# EAGLE design Prototype Board bad routing (EAGLE 9.6.2)
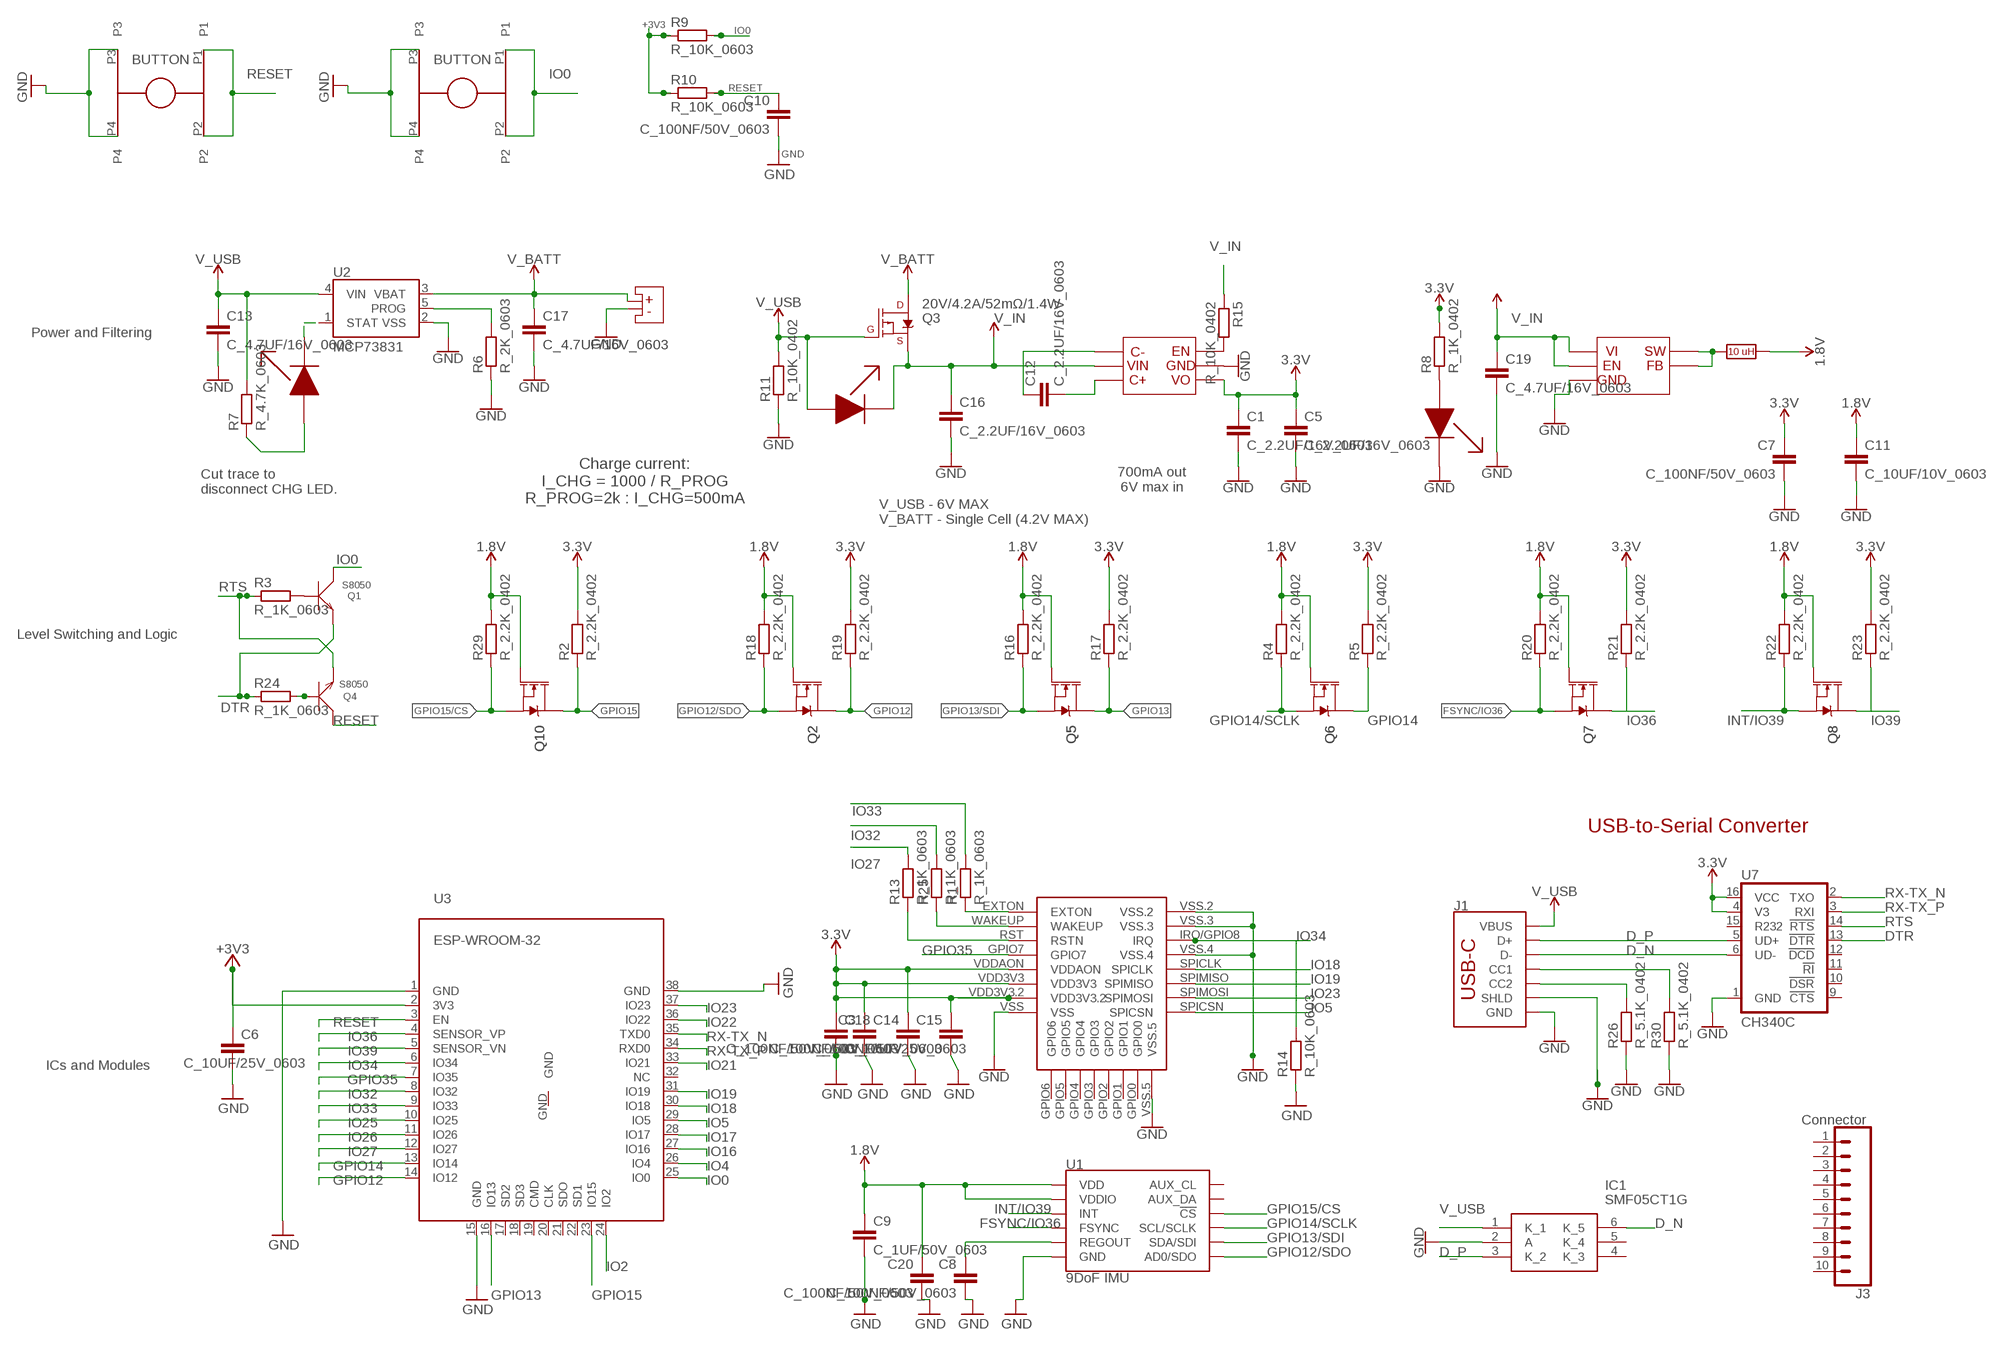
[diagram p0: schematic, sheet 1]

## Parts
C1  C_2.2UF/16V_0603  [C0603]
C3  C_100NF/50V_0603  [C0603]
C5  C_2.2UF/16V_0603  [C0603]
C6  C_10UF/25V_0603  [C0603]
C7  C_100NF/50V_0603  [C0603]
C8  C_100NF/50V_0603  [C0603]
C9  C_1UF/50V_0603  [C0603]
C10  C_100NF/50V_0603  [C0603]
C11  C_10UF/10V_0603  [C0603]
C12  C_2.2UF/16V_0603  [C0603]
C13  C_4.7UF/16V_0603  [C0603]
C14  C_100NF/50V_0603  [C0603]
C15  C_100NF/50V_0603  [C0603]
C16  C_2.2UF/16V_0603  [C0603]
C17  C_4.7UF/16V_0603  [C0603]
C18  C_10UF/25V_0603  [C0603]
C19  C_4.7UF/16V_0603  [C0603]
C20  C_100NF/50V_0603  [C0603]
IC1  SMF05CT1G  [SOT65P210X110-6N]
J1  USB Type C  USB_C_2-LAYER_PADS  [USB-C-16P-2LAYER-PADS]
J3  Connector  CONN_10"  [1X10]
Q1  S8050  TRANSISTOR-NPN-SOT23  [SOT23]
Q2  20V/0.2A/8MHz/1.2Ω/1Vth  MOSFET-NCH-RE1C002UN  [SOT-416FL]
Q3  20V/4.2A/52mΩ/1.4W  MOSFET_PCH-DMG2305UX-7  [SOT23-3@1]
Q4  S8050  TRANSISTOR-NPN-SOT23  [SOT23]
Q5  20V/0.2A/8MHz/1.2Ω/1Vth  MOSFET-NCH-RE1C002UN  [SOT-416FL]
Q6  20V/0.2A/8MHz/1.2Ω/1Vth  MOSFET-NCH-RE1C002UN  [SOT-416FL]
Q7  20V/0.2A/8MHz/1.2Ω/1Vth  MOSFET-NCH-RE1C002UN  [SOT-416FL]
Q8  20V/0.2A/8MHz/1.2Ω/1Vth  MOSFET-NCH-RE1C002UN  [SOT-416FL]
Q10  20V/0.2A/8MHz/1.2Ω/1Vth  MOSFET-NCH-RE1C002UN  [SOT-416FL]
R1  R_1K_0603  [R0603]
R2  R_2.2K_0402  [R0402]
R3  R_1K_0603  [R0603]
R4  R_2.2K_0402  [R0402]
R5  R_2.2K_0402  [R0402]
R6  R_2K_0603  [R0603]
R7  R_4.7K_0603  [R0603]
R8  R_1K_0402  [R0402]
R9  R_10K_0603  [R0603]
R10  R_10K_0603  [R0603]
R11  R_10K_0402  [R0402]
R13  R_1K_0603  [R0603]
R14  R_10K_0603  [R0603]
R15  R_10K_0402  [R0402]
R16  R_2.2K_0402  [R0402]
R17  R_2.2K_0402  [R0402]
R18  R_2.2K_0402  [R0402]
R19  R_2.2K_0402  [R0402]
R20  R_2.2K_0402  [R0402]
R21  R_2.2K_0402  [R0402]
R22  R_2.2K_0402  [R0402]
R23  R_2.2K_0402  [R0402]
R24  R_1K_0603  [R0603]
R25  R_1K_0603  [R0603]
R26  R_5.1K_0402  [R0402]
R29  R_2.2K_0402  [R0402]
R30  R_5.1K_0402  [R0402]
U1  9DoF IMU  ICM-20948  [QFN24-3X3]
U2  MCP73831  [SOT23-5]
U3  ESP-WROOM-32  [ESP-WROOM-32]
U5  DWM1000  [DWM1000]
U7  CH340C  [SO016]
U$1  K2-6639SP-C4SC-04_C83206  [K2-6639SP-C4SC-04]
U$2  MLF2012  [MLF2012]
U$3  K2-6639SP-C4SC-04_C83206  [K2-6639SP-C4SC-04]
U$4  TPS62202DBVR  [TPS62202DBVR]
U$5  HE9008M6R  [HE9008M6R]
U$6  19-217/GHC-YR1S2/3T  [19-217/GHC-YR1S2/3T]
U$7  19-217/GHC-YR1S2/3T  [19-217/GHC-YR1S2/3T]
U$8  SM02B_PASS_TB_LF  [SM02B_PASS_TB_LF]
U$9  19-217/GHC-YR1S2/3T  [19-217/GHC-YR1S2/3T]

## Nets
1.8V: C9.1 C11.1 C20.1 Q2.1(G) Q5.1(G) Q6.1(G) Q7.1(G) Q8.1(G) Q10.1(G) R4.2 R16.2 R18.2 R20.2 R22.2 R29.2 U1.8(VDDIO) U1.13(VDD) U$2.2
3.3V: C1.1 C3.1 C5.1 C7.1 C14.1 C15.1 C18.1 R2.2 R5.2 R8.2 R17.2 R19.2 R21.2 R23.2 U5.VDD3V3 U5.VDD3V3.2 U5.VDDAON U7.4(V3) U7.16(VCC) U$5.VOUT(VO)
+3V3: C6.1 R9.1 R10.1 U3.2(3V3)
CHG_LED: R7.1 U$6.1
D_N [diff-pair-D]: IC1.6(K_5) J1.A7(D-) J1.B7(D-) U7.6(UD-)
D_P [diff-pair-D]: IC1.3(K_2) J1.A6(D+) J1.B6(D+) U7.5(UD+)
DTR: Q1.2(E) R24.1 U7.13(!DTR)
FSYNC/IO36: Q7.2(S) R20.1 U1.11(FSYNC)
GND: C1.2 C3.2 C5.2 C6.2 C7.2 C8.2 C9.2 C10.2 C11.2 C13.2 C14.2 C15.2 C16.2 C17.2 C18.2 C19.2 C20.2 IC1.2(A) J1.GND J1.GND2(GND) J1.SHLD1(SHLD) J1.SHLD2(SHLD) J1.SHLD3(SHLD) J1.SHLD4(SHLD) R6.1 R11.1 R14.1 R26.1 R30.1 U1.18(GND) U1.20(GND) U2.2(VSS) U3.1(GND) U3.15(GND) U3.38(GND) U5.VSS U5.VSS.2 U5.VSS.3 U5.VSS.4 U5.VSS.5 U7.1(GND) U$1.P3 U$1.P4 U$3.P3 U$3.P4 U$4.2(GND) U$5.GND U$8.3(-) U$9.2
GPIO12: Q2.3(D) R19.1 U3.14(IO12)
GPIO12/SDO: Q2.2(S) R18.1 U1.9(AD0/SDO)
GPIO13: Q5.3(D) R17.1 U3.16(IO13)
GPIO13/SDI: Q5.2(S) R16.1 U1.24(SDA/SDI)
GPIO14: Q6.3(D) R5.1 U3.13(IO14)
GPIO14/SCLK: Q6.2(S) R4.1 U1.23(SCL/SCLK)
GPIO15: Q10.3(D) R2.1 U3.23(IO15)
GPIO15/CS: Q10.2(S) R29.1 U1.22(!CS)
GPIO35: U3.7(IO35) U5.GPIO7
INT/IO39: Q8.2(S) R22.1 U1.12(INT)
IO0: Q1.3(C) R9.2 U3.25(IO0) U$3.P1 U$3.P2
IO2: U3.24(IO2)
IO4: U3.26(IO4)
IO5: U3.29(IO5) U5.SPICSN
IO16: U3.27(IO16)
IO17: U3.28(IO17)
IO18: U3.30(IO18) U5.SPICLK
IO19: U3.31(IO19) U5.SPIMISO
IO21: U3.33(IO21)
IO22: U3.36(IO22)
IO23: U3.37(IO23) U5.SPIMOSI
IO25: U3.10(IO25)
IO26: U3.11(IO26)
IO27: R13.2 U3.12(IO27)
IO32: R25.2 U3.8(IO32)
IO33: R1.2 U3.9(IO33)
IO34: R14.2 U3.6(IO34) U5.IRQ/GPIO8(IRQ)
IO36: Q7.3(D) R21.1 U3.4(SENSOR_VP)
IO39: Q8.3(D) R23.1 U3.5(SENSOR_VN)
N$1: Q4.1(B) R24.2
N$2: Q1.1(B) R3.2
N$3: R6.2 U2.5(PROG)
N$4: R8.1 U$9.1
N$5: J1.B5(CC2) R26.2
N$6: J1.A5(CC1) R30.2
N$7: U2.1(STAT) U$6.2
N$8: U$2.1 U$4.4(FB) U$4.5(SW)
N$9: R15.2 U$5.EN
N$10: R1.1 U5.EXTON
N$11: R25.1 U5.WAKEUP
N$12: R13.1 U5.RST(RSTN)
N$13: C8.1 U1.10(REGOUT)
N$14: C12.1 U$5.C-
N$15: C12.2 U$5.C+
RESET: C10.1 Q4.3(C) R10.2 U3.3(EN) U$1.P1 U$1.P2
RTS: Q4.2(E) R3.1 U7.14(!RTS)
RX-TX_N [diff-pair-RT]: U3.35(TXD0) U7.2(TXO)
RX-TX_P [diff-pair-RT]: U3.34(RXD0) U7.3(RXI)
V_BATT: C17.1 Q3.3(D) U2.3(VBAT) U$8.4(+)
V_IN: C16.1 C19.1 Q3.2(S) R15.1 U$4.1(VI) U$4.3(EN) U$5.VIN U$7.2 ; supply symbol labelled VIN
V_USB: C13.1 IC1.1(K_1) J1.VBUS1(VBUS) J1.VBUS2(VBUS) Q3.1(G) R7.2 R11.2 U2.4(VIN) U$7.1
Unconnected: IC1.4(K_3) IC1.5(K_4) J3.1 J3.2 J3.3 J3.4 J3.5 J3.6 J3.7 J3.8 J3.9 J3.10 U1.7(AUX_CL) U1.21(AUX_DA) U3.17(SD2) U3.18(SD3) U3.19(CMD) U3.20(CLK) U3.21(SDO) U3.22(SD1) U3.32(NC) U3.GND U5.GPIO0 U5.GPIO1 U5.GPIO2 U5.GPIO3 U5.GPIO4 U5.GPIO5 U5.GPIO6 U7.9(!CTS) U7.10(!DSR) U7.11(!RI) U7.12(!DCD) U7.15(R232)

## Notes on the sheet
- Power and Filtering
- 700mA out
  6V max in
- Charge current:
  I_CHG = 1000 / R_PROG
  R_PROG=2k : I_CHG=500mA
- Cut trace to 
  disconnect CHG LED.
- V_USB - 6V MAX
  V_BATT - Single Cell (4.2V MAX)
- Level Switching and Logic
- USB-to-Serial Converter
- ICs and Modules

## Library data of the parts
C1 C5 C12 C16 = JLC PCB Basic Parts_loc:C_: Capacitor General purpose SMD Capacitor; LCSC_DATASHEET: https://datasheet.lcsc.com/lcsc/1810271109_Samsung-Electro-Mechanics-CL10A225KO8NNNC_C23630.pdf; LCSC_PART: C23630; LCSC_ROTATION_CCW: 0; LCSC_STOCK: 1324345; PROPERTIES: 16V 2.2uF X5R ±10% 0603 ROHS
C3 C7 C8 C10 C14 C15 C20 = JLC PCB Basic Parts_loc:C_: Capacitor General purpose SMD Capacitor; LCSC_DATASHEET: https://datasheet.lcsc.com/lcsc/1809301912_YAGEO-CC0603KRX7R9BB104_C14663.pdf; LCSC_PART: C14663; LCSC_ROTATION_CCW: 0; LCSC_STOCK: 7111530; PROPERTIES: 50V 100nF X7R ±10% 0603 ROHS
C6 C18 = JLC PCB Basic Parts_loc:C_: Capacitor General purpose SMD Capacitor; LCSC_DATASHEET: https://datasheet.lcsc.com/lcsc/1811110921_Samsung-Electro-Mechanics-CL10A106MA8NRNC_C96446.pdf; LCSC_PART: C96446; LCSC_ROTATION_CCW: 0; LCSC_STOCK: 119091; PROPERTIES: X5R 25V ±20% 10uF 0603 ROHS
C9 = JLC PCB Basic Parts_loc:C_: Capacitor General purpose SMD Capacitor; LCSC_DATASHEET: https://datasheet.lcsc.com/lcsc/1810261812_Samsung-Electro-Mechanics-CL10A105KB8NNNC_C15849.pdf; LCSC_PART: C15849; LCSC_ROTATION_CCW: 0; LCSC_STOCK: 14650365; PROPERTIES: 50V 1uF X5R ±10% 0603 ROHS
C11 = JLC PCB Basic Parts_loc:C_: Capacitor General purpose SMD Capacitor; LCSC_DATASHEET: https://datasheet.lcsc.com/lcsc/1810191219_Samsung-Electro-Mechanics-CL10A106KP8NNNC_C19702.pdf; LCSC_PART: C19702; LCSC_ROTATION_CCW: 0; LCSC_STOCK: 2089400; PROPERTIES: 10V 10uF X5R ±10% 0603 ROHS
C13 C17 C19 = JLC PCB Basic Parts_loc:C_: Capacitor General purpose SMD Capacitor; LCSC_DATASHEET: https://datasheet.lcsc.com/lcsc/1810261514_Samsung-Electro-Mechanics-CL10A475KO8NNNC_C19666.pdf; LCSC_PART: C19666; LCSC_ROTATION_CCW: 0; LCSC_STOCK: 2027167; PROPERTIES: 16V 4.7uF X5R ±10% 0603 ROHS
IC1 = SMF05CT1G:SMF05CT1G: 5-Line Transient Voltage Suppressor Array Source: Datasheet; DESCRIPTION: 5-Line Transient Voltage Suppressor Array; HEIGHT: 1.1mm; MANUFACTURER_NAME: onsemi; MANUFACTURER_PART_NUMBER: SMF05CT1G; MOUSER_PART_NUMBER: 863-SMF05CT1G; MOUSER_PRICE-STOCK: https://www.mouser.co.uk/ProductDetail/onsemi/SMF05CT1G?qs=xZq1yRCsb1c8sZHBbx4IBw%3D%3D
J1 = SparkFun-Connectors:USB_C: USB Type C 16Pin Connector Super Speed pins not available on the 16-pin purely SMD connector so this part is best for USB 2.0 implementations. D1 and D2 are tied together enabling D+/- no matter which way the cable is plugged into the connector. The two channel configuration pins (CC1/2) are exposed. These are normally connected to ground via 5.1k resistors but can be reconfigured for high current/high power applications. **4-LAYER BOARD WARNING!!** If designing 4-layer board, make sure to select the variant _4-LAYER-ISOLATED. The linked footprint (USB-C-16-4LAYER-ISOLATED) includes some very necessary cutout polygons in the inner layers (2 and 15). This prevents the PTH mounting shield legs on the USB connector from electrically connecting any other polygons on the inner layers (usually VCC and GND).; PROD_ID: CONN-14122
J3 = SparkFun-Connectors:CONN_10: Multi connection point. Often used as Generic Header-pin footprint for 0.1 inch spaced/style header connections On any of the 0.1 inch spaced packages, you can populate with these: Break Away Headers - Straight (PRT-00116) Break Away Male Headers - Right Angle (PRT-00553) Female Headers (PRT-00115) Break Away Headers - Machine Pin (PRT-00117) Break Away Female Headers - Swiss Machine Pin (PRT-00743) Arduino Stackable Header - 10 Pin (PRT-11376) For SCREWTERMINALS and SPRING TERMINALS visit here: Screw Terimnals on SparkFun.com (5mm/3.5mm/2.54mm spacing) This device is also useful as a general connection point to wire up your design to another part of your project. Our various solder wires solder well into these plated through hole pads. Hook-Up Wire - Assortment (Stranded, 22 AWG) (PRT-11375) Hook-Up Wire - Assortment (Solid Core, 22 AWG) (PRT-11367) View the entire wire category on our website here Special notes: Molex polarized connector foot print use with SKU : PRT-08231 with associated crimp pins and housings. 1MM SMD Version SKU: PRT-10208 NOTES ON THE VARIANTS LOCK and LOCK_LONGPADS... This footprint was designed to help hold the alignment of a through-hole component (i.e. 6-pin header) while soldering it into place. You may notice that each hole has been shifted either up or down by 0.005 of an inch from it's more standard position (which is a perfectly straight line). This slight alteration caused the pins (the squares in the middle) to touch the edges of the holes. Because they are alternating, it causes a "brace" to hold the component in place. 0.005 has proven to be the perfect amount of "off-center" position when using our standard breakaway headers. Although looks a little odd when you look at the bare footprint, once you have a header in there, the alteration is very hard to notice. Also,if you push a header all the way into place, it is covered up entirely on the bottom side.; PROD_ID: CONN-11563
Q1 Q4 = Discrete:TRANSISTOR-NPN*: NPN audion
Q2 Q5-Q8 Q10 = SparkFun-DiscreteSemi:MOSFET-NCH: N-channel MOSFETs Voltage controlled devices that allow control of high current outputs. SparkFun Products: SparkFun OpenScale <https://www.sparkfun.com/products/13261> SparkFun Digital Sandbox <https://www.sparkfun.com/products/12651> SparkFun Monster Moto Shield <https://www.sparkfun.com/products/10182> SparkFun MOSFET Power Controller <https://www.sparkfun.com/products/11214>; PROD_ID: TRANS_14399
Q3 = SparkFun-DiscreteSemi:MOSFET_PCH: P-channel MOSFETs Voltage controlled devices that allow control of high current outputs. SparkFun Products: SparkFun ESP32 Thing <https://www.sparkfun.com/products/13907> SparkFun ESP8266 Thing <https://www.sparkfun.com/products/13231> SparkFun Pi Servo HAT V2 <https://www.sparkfun.com/products/15316> DMG2305UX-7 (20V/4.2A/SOT23-3); PROD_ID: TRANS-14388
R1 R3 R13 R24 R25 = JLC PCB Basic Parts_loc:R_: Resistor General purpose SMD Resistor; LCSC_DATASHEET: https://datasheet.lcsc.com/lcsc/2110252030_UNI-ROYAL-Uniroyal-Elec-0603WAF1001T5E_C21190.pdf; LCSC_PART: C21190; LCSC_ROTATION_CCW: 0; LCSC_STOCK: 5175299; PROPERTIES: ±1% 1/10W Thick Film Resistors 75V ±100ppm -55°C~+155°C 1kOhm 0603 ROHS
R2 R4 R5 R16-R23 R29 = JLC PCB Basic Parts_loc:R_: Resistor General purpose SMD Resistor; LCSC_DATASHEET: https://datasheet.lcsc.com/lcsc/2110260030_UNI-ROYAL-Uniroyal-Elec-0402WGF2201TCE_C25879.pdf; LCSC_PART: C25879; LCSC_ROTATION_CCW: 0; LCSC_STOCK: 387501; PROPERTIES: ±1% 1/16W Thick Film Resistors 50V ±100ppm -55°C~+155°C 2.2kOhm 0402 ROHS
R6 = JLC PCB Basic Parts_loc:R_: Resistor General purpose SMD Resistor; LCSC_DATASHEET: https://datasheet.lcsc.com/lcsc/2110252130_UNI-ROYAL-Uniroyal-Elec-0603WAF2001T5E_C22975.pdf; LCSC_PART: C22975; LCSC_ROTATION_CCW: 0; LCSC_STOCK: 3372290; PROPERTIES: ±1% 1/10W Thick Film Resistors 75V ±100ppm -55°C~+155°C 2kOhm 0603 ROHS
R7 = JLC PCB Basic Parts_loc:R_: Resistor General purpose SMD Resistor; LCSC_DATASHEET: https://datasheet.lcsc.com/lcsc/2110252130_UNI-ROYAL-Uniroyal-Elec-0603WAF4701T5E_C23162.pdf; LCSC_PART: C23162; LCSC_ROTATION_CCW: 0; LCSC_STOCK: 3103173; PROPERTIES: ±1% 1/10W Thick Film Resistors 75V ±100ppm -55°C~+155°C 4.7kOhm 0603 ROHS
R8 = JLC PCB Basic Parts_loc:R_: Resistor General purpose SMD Resistor; LCSC_DATASHEET: https://datasheet.lcsc.com/lcsc/2110251730_UNI-ROYAL-Uniroyal-Elec-0402WGF1001TCE_C11702.pdf; LCSC_PART: C11702; LCSC_ROTATION_CCW: 0; LCSC_STOCK: 3758383; PROPERTIES: ±1% 1/16W Thick Film Resistors 50V ±100ppm -55°C~+155°C 1kOhm 0402 ROHS
R9 R10 R14 = JLC PCB Basic Parts_loc:R_: Resistor General purpose SMD Resistor; LCSC_DATASHEET: https://datasheet.lcsc.com/lcsc/2110260030_UNI-ROYAL-Uniroyal-Elec-0603WAF1002T5E_C25804.pdf; LCSC_PART: C25804; LCSC_ROTATION_CCW: 0; LCSC_STOCK: 7979018; PROPERTIES: ±1% 1/10W Thick Film Resistors 75V ±100ppm -55°C~+155°C 10kOhm 0603 ROHS
R11 R15 = JLC PCB Basic Parts_loc:R_: Resistor General purpose SMD Resistor; LCSC_DATASHEET: https://datasheet.lcsc.com/lcsc/2110260030_UNI-ROYAL-Uniroyal-Elec-0402WGF1002TCE_C25744.pdf; LCSC_PART: C25744; LCSC_ROTATION_CCW: 0; LCSC_STOCK: 11564817; PROPERTIES: ±1% 1/16W Thick Film Resistors 50V ±100ppm -55°C~+155°C 10kOhm 0402 ROHS
R26 R30 = JLC PCB Basic Parts_loc:R_: Resistor General purpose SMD Resistor; LCSC_DATASHEET: https://datasheet.lcsc.com/lcsc/2110260030_UNI-ROYAL-Uniroyal-Elec-0402WGF5101TCE_C25905.pdf; LCSC_PART: C25905; LCSC_ROTATION_CCW: 0; LCSC_STOCK: 1228443; PROPERTIES: ±1% 1/16W Thick Film Resistors 50V ±100ppm -55°C~+155°C 5.1kOhm 0402 ROHS
U1 = SparkFun-Sensors:ICM-20948: ICM-20948 9 Degree of Freedom IMU World’s lowest power 9-axis MotionTracking device that is ideally suited for smartphones, tablets, wearable sensors, and IoT applications. Includes onboard Digital Motion Processor to offload computations from the host processor Datasheet <https://cdn.sparkfun.com/assets/learn_tutorials/5/5/0/MPU9250REV1.0.pdf> SparkFun Products: SparkFun IMU Breakout - ICM-20948 <https://www.sparkfun.com/products/15182>; PROD_ID: IC-14247
U2 = SparkFun-IC-Power:MCP73831: MCP73831T Li-Ion, Li-Pol Controller Miniature single cell, fully integrated Li-Ion, Li-polymer charge management controller Datasheet <http://ww1.microchip.com/downloads/en/DeviceDoc/20001984g.pdf> SparkFun Products: SparkFun ESP32 Thing <https://www.sparkfun.com/products/13907> SparkFun 9DoF Razor IMU M0 <https://www.sparkfun.com/products/14001>; PROD_ID: IC-09995
U3 = ESP32:ESP-WROOM-32
U5 = DWM1000:DWM1000
U7 = SparkFun-IC-Comms:CH340C; PROD_ID: IC-14038
U$1 U$3 = customlib:K2-6639SP-C4SC-04_C83206: K2-6639SP-C4SC-04_C83206 button, https://datasheet.lcsc.com/lcsc/2108131530_Korean-Hroparts-Elec-K2-6639SP-C4SC-04_C83206.pdf
U$2 = customlib:MLF2012: MLF2012 0805 10uH Inductor
U$4 = customlib:TPS62202DBVR
U$5 = customlib:HE9008M6R
U$6 U$7 U$9 = customlib:19-217/GHC-YR1S2/3T
U$8 = customlib:SM02B_PASS_TB_LF

## Net classes
0 default: width 0.127 mm, drill 0.305 mm
1 power: width 0.305 mm, drill 0.305 mm

## Board
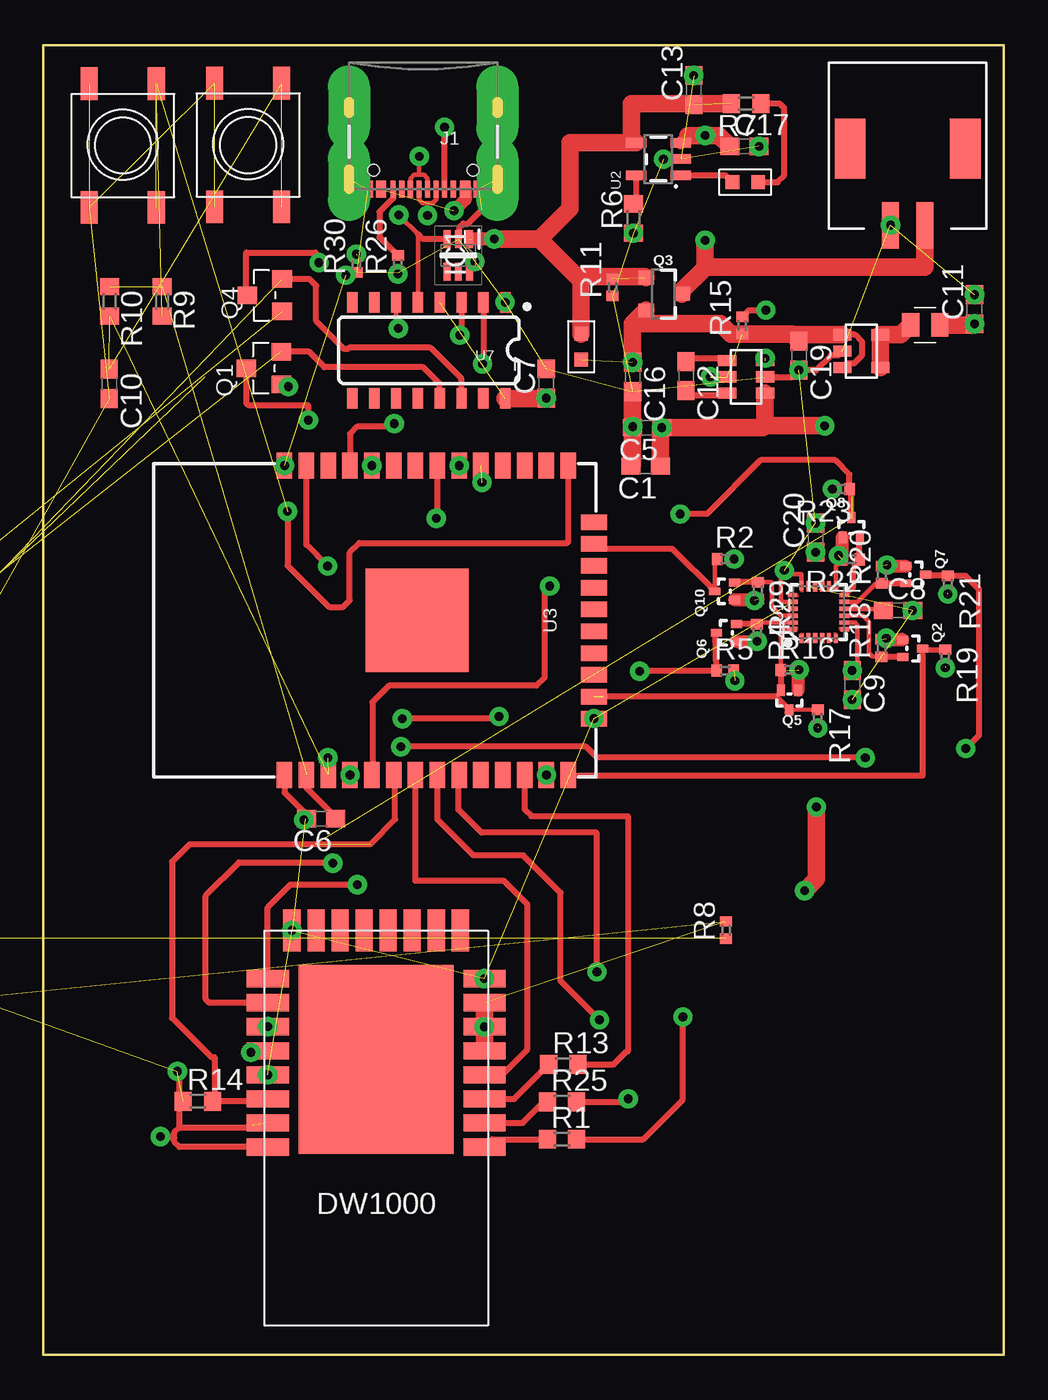
[diagram p1: board, top side]
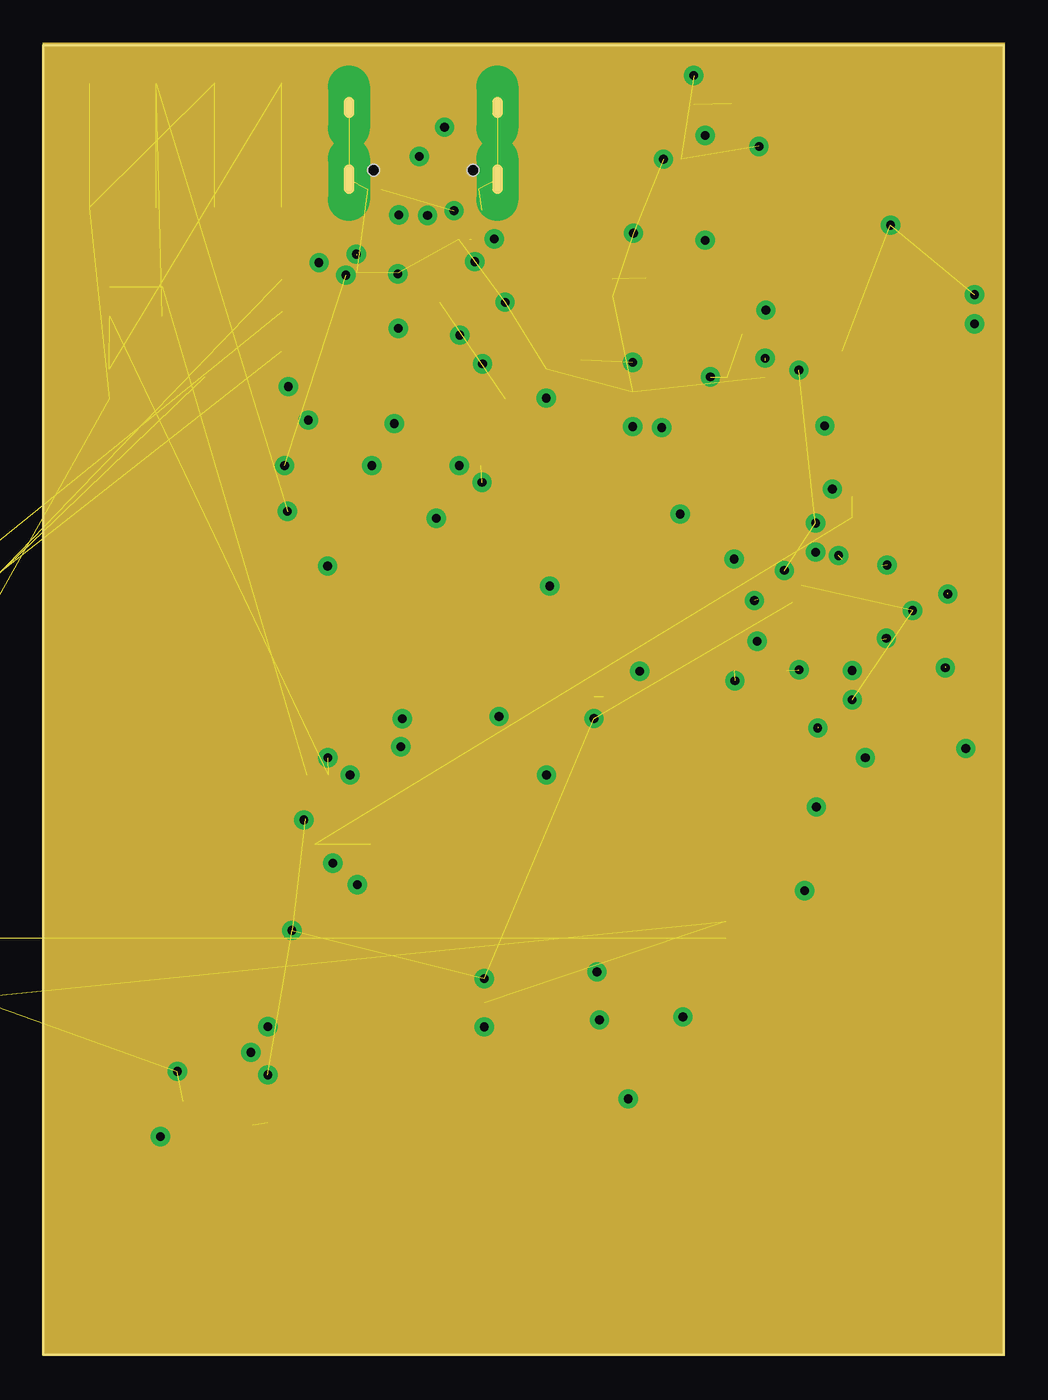
[diagram p2: board, inner layer Route2]
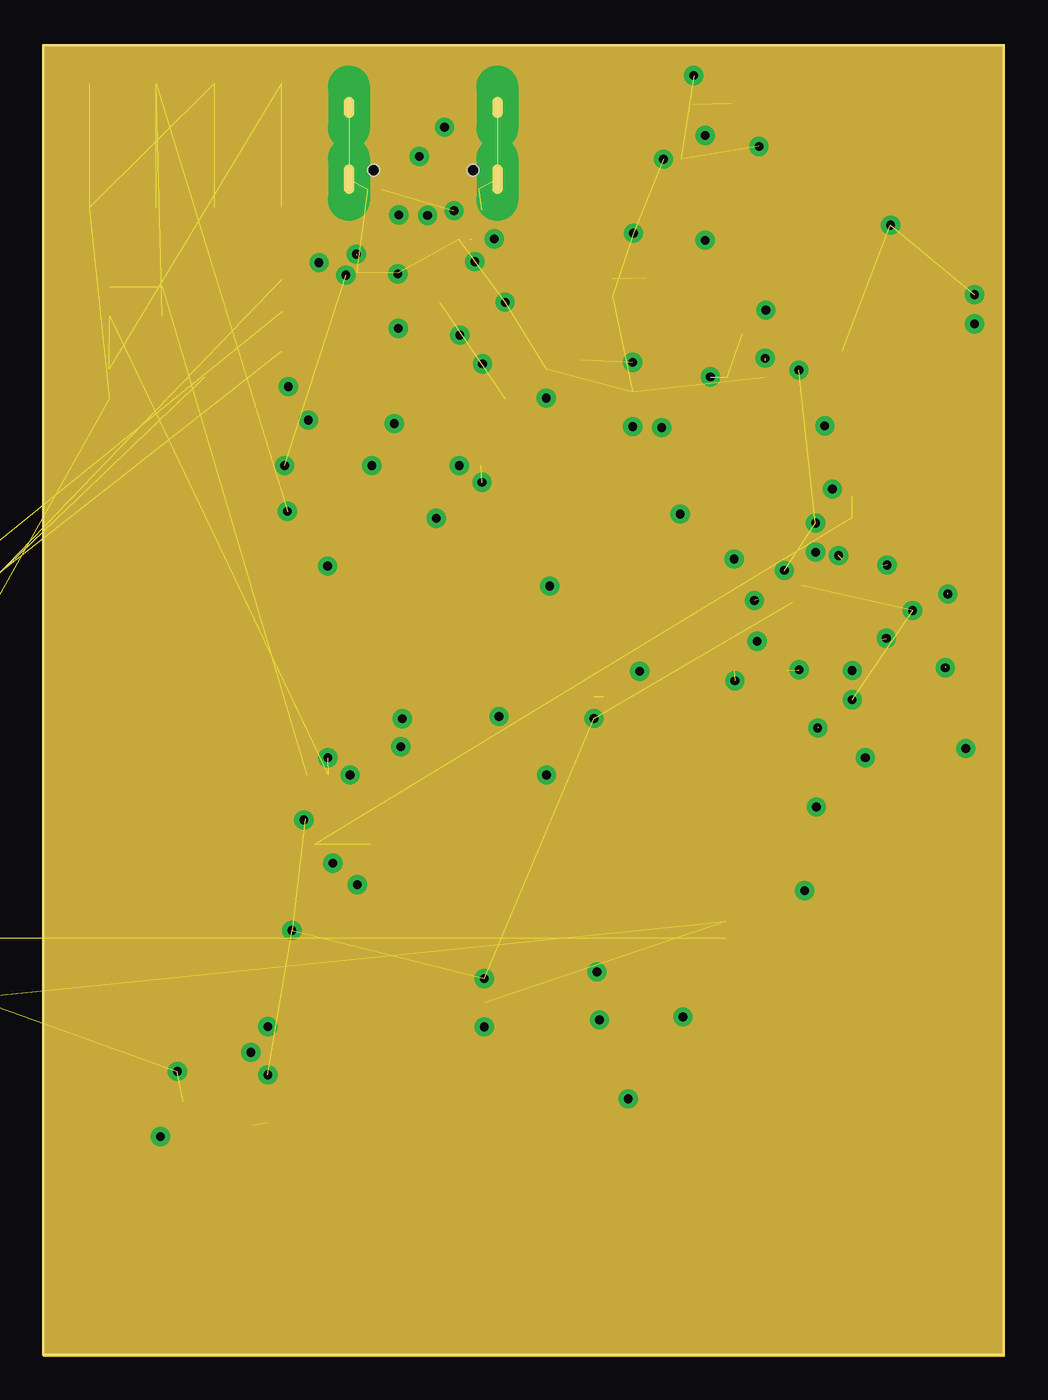
[diagram p3: board, inner layer Route15]
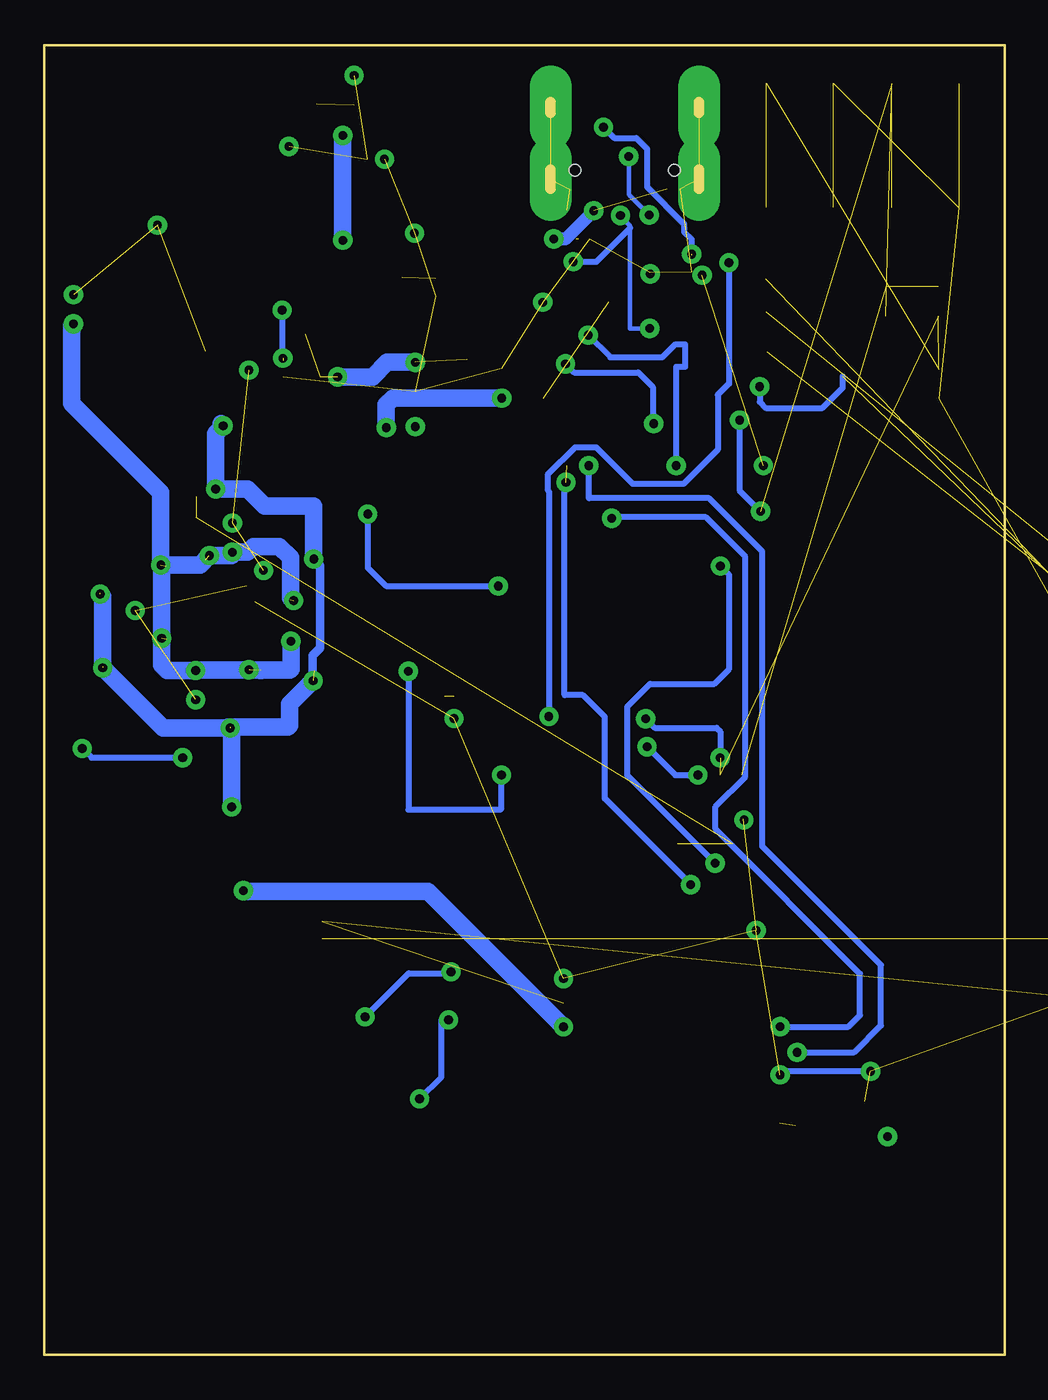
[diagram p4: board, bottom side, seen from below]

Size 55.88 x 76.2 mm. Coordinates in mm from the lower left corner, seen from the top.
Outline: 55.88,0 55.88,76.2 0,76.2 0,0 55.88,0
Copper layers (1+2*15+16): Top 0.035mm / dielectric 0.2104mm / Route2 0.0152mm / dielectric 1.065mm / Route15 0.0152mm / dielectric 0.2104mm / Bottom 0.035mm
Design rules "default *": minimum track width 3.5mil, minimum drill 20mil, track to track 3.5mil, track to pad 8mil, pad to pad 5mil, via to via 20mil, smd to smd 3.5mil, copper to edge 40mil, drill to drill 20mil, minimum pad ring 40mil, minimum via ring 12mil, stop-mask expansion 4mil, vias tented up to drill 0mil, thermal gap 10mil
tKeepout: area 2.6,0.8 to 36.1,11.3; area 5.6,30.7 to 13.1,54.7

### Footprints (pad centres in the part's own frame; a part is rotated, then mirrored left to right if it is on the bottom)
C0603 = smd 1.1 x 1: 1 -0.85,0; 2 0.85,0
SOT65P210X110-6N = smd 1.05 x 0.4: 1 -0.95,0.65; 2 -0.95,0; 3 -0.95,-0.65; 4 0.95,-0.65; 5 0.95,0; 6 0.95,0.65
USB-C-16P-2LAYER-PADS = smd 0.3 x 1: A5 -1.25,-0.34; A6 -0.25,-0.34; A7 0.25,-0.34; A8 1.25,-0.34; B5 1.75,-0.34; B6 0.75,-0.34; B7 -0.75,-0.34; B8 -1.75,-0.34 | smd 0.6 x 1: GND -3.225,-0.34; GND2 3.225,-0.34; VBUS1 -2.45,-0.34; VBUS2 2.45,-0.34 | drill 0.4 pad 0.6 long: SHLD1 -4.318,-0.915; SHLD2 4.318,-0.915; SHLD3 -4.318,-5.095; SHLD4 4.318,-5.095 | hole 0.65: -2.89,-1.445; 2.89,-1.445
1X10 = drill 1.016 pad 1.88: 1 0,0; 2 2.54,0; 3 5.08,0; 4 7.62,0; 5 10.16,0; 6 12.7,0; 7 15.24,0; 8 17.78,0; 9 20.32,0; 10 22.86,0
SOT23 = smd 1.016 x 1.143: 1 -0.95,-1.016; 2 0.95,-1.016; 3 0,1.016
SOT-416FL = smd 0.46 x 0.65: 1 -0.5,-1.1; 2 0.5,-1.1; 3 0,0.05
SOT23-3@1 = smd 0.8 x 0.9: 1 -0.95,-1; 2 0.95,-1; 3 0,1.1
R0603 = smd 1 x 1.1: 1 -0.85,0; 2 0.85,0
R0402 = smd 0.6 x 0.7: 1 -0.5,0; 2 0.5,0
QFN24-3X3 = smd 0.495 x 0.25: 1 -1.552,1; 6 -1.552,-1; 13 1.552,-1; 18 1.552,1 | smd 0.6 x 0.25: 2 -1.5,0.6; 3 -1.5,0.2; 4 -1.5,-0.2; 5 -1.5,-0.6; 14 1.5,-0.6; 15 1.5,-0.2; 16 1.5,0.2; 17 1.5,0.6 | smd 0.25 x 0.495: 7 -1,-1.552; 12 1,-1.552; 19 1,1.552; 24 -1,1.552 | smd 0.25 x 0.6: 8 -0.6,-1.5; 9 -0.2,-1.5; 10 0.2,-1.5; 11 0.6,-1.5; 20 0.6,1.5; 21 0.2,1.5; 22 -0.2,1.5; 23 -0.6,1.5
SOT23-5 = smd 0.55 x 1.2: 1 -0.95,-1.3; 2 0,-1.3; 3 0.95,-1.3; 4 0.95,1.3; 5 -0.95,1.3
ESP-WROOM-32 = smd 0.9 x 1.5: 1 7.7,9; 2 6.43,9; 3 5.16,9; 4 3.89,9; 5 2.62,9; 6 1.35,9; 7 0.08,9; 8 -1.19,9; 9 -2.46,9; 10 -3.73,9; 11 -5,9; 12 -6.27,9; 13 -7.54,9; 14 -8.81,9; 25 -8.81,-9; 26 -7.54,-9; 27 -6.27,-9; 28 -5,-9; 29 -3.73,-9; 30 -2.46,-9; 31 -1.19,-9; 32 0.08,-9; 33 1.35,-9; 34 2.62,-9; 35 3.89,-9; 36 5.16,-9; 37 6.43,-9; 38 7.7,-9 | smd 1.5 x 0.9: 15 -10.3,5.715; 16 -10.3,4.445; 17 -10.3,3.175; 18 -10.3,1.905; 19 -10.3,0.635; 20 -10.3,-0.635; 21 -10.3,-1.905; 22 -10.3,-3.175; 23 -10.3,-4.445; 24 -10.3,-5.715 | smd 6 x 6: GND 0,0
DWM1000 = smd 2.45 x 1: EXTON -2.8,12.6; GPIO7 -2.8,8.4; IRQ/GPIO8 9.8,9.8; RST -2.8,9.8; SPICLK 9.8,7; SPICSN 9.8,2.8; SPIMISO 9.8,5.6; SPIMOSI 9.8,4.2; VDD3V3 -2.8,4.2; VDD3V3.2 -2.8,5.6; VDDAON -2.8,7; VSS -2.8,2.8; VSS.2 9.8,12.6; VSS.3 9.8,11.2; VSS.4 9.8,8.4; WAKEUP -2.8,11.2 | smd 9 x 11: GND 3.5,7.5 | smd 1 x 2.45: GPIO0 7,0; GPIO1 5.6,0; GPIO2 4.2,0; GPIO3 2.8,0; GPIO4 1.4,0; GPIO5 0,0; GPIO6 -1.4,0; VSS.5 8.4,0
SO016 = smd 0.6 x 1.2: 1 -4.445,-2.8; 2 -3.175,-2.8; 3 -1.905,-2.8; 4 -0.635,-2.8; 5 0.635,-2.8; 6 1.905,-2.8; 7 3.175,-2.8; 8 4.445,-2.8; 9 4.445,2.8; 10 3.175,2.8; 11 1.905,2.8; 12 0.635,2.8; 13 -0.635,2.8; 14 -1.905,2.8; 15 -3.175,2.8; 16 -4.445,2.8
K2-6639SP-C4SC-04 = smd 1 x 1.9: P1 1.95,3.6; P2 1.95,-3.6; P3 -1.95,3.6; P4 -1.95,-3.6
MLF2012 = smd 1 x 1.35: 1 0.85,0; 2 -0.85,0
TPS62202DBVR = smd 1.06 x 0.65: 1 1.1,-0.95; 2 1.1,0; 3 1.1,0.95; 4 -1.1,0.95; 5 -1.1,-0.95
HE9008M6R = smd 0.65 x 1.06: C+ -0.95,1.1; C- 0.95,1.1; EN 0.95,-1.1; GND 0,-1.1; VIN 0,1.1; VOUT -0.95,-1.1
19-217/GHC-YR1S2/3T = smd 0.8 x 0.8: 1 -0.75,0; 2 0.75,0
SM02B_PASS_TB_LF = smd 1.8 x 3.5: 1 -3.35,2.098; 2 3.35,2.098 | smd 1 x 2.7: 3 -1,-2.352; 4 1,-2.352

### Placement (x,y rotation side)
C1  35.05,51.71 180 top
C3  -17.04,18.59 270 top  (outside the outline)
C5  35.13,53.95 180 top
C6  16.15,31.19 180 top
C7  29.26,56.52 90 top
C8  49.73,43.31 0 top
C9  47.07,38.96 270 top
C10  3.84,56.49 270 top
C11  54.18,60.83 90 top
C12  37.39,56.95 270 top
C13  37.85,73.58 90 top
C14  -22.12,18.59 270 top  (outside the outline)
C15  -27.2,18.59 270 top  (outside the outline)
C16  34.29,56.9 270 top
C17  40.79,70.31 0 top
C18  -19.58,18.34 270 top  (outside the outline)
C19  43.97,58.14 270 top
C20  44.93,47.55 90 top
IC1  24.14,63.97 270 top
J1  22.1,67.49 180 top
J3  -10.03,72.26 270 top  (outside the outline)
Q1  12.83,57.4 90 top
Q2  51.1,41.1 270 top
Q3  36.07,61.72 270 top
Q4  12.88,61.65 90 top
Q5  43.41,37.57 180 top
Q6  39.22,42.01 90 top
Q7  51.28,45.39 270 top
Q8  47.02,48.67 0 top
Q10  39.12,44.42 90 top
R1  30.18,12.55 0 top
R2  39.7,46.3 0 top
R3  -23.34,24.79 180 top  (outside the outline)
R4  41.53,42.01 270 top
R5  39.67,39.8 0 top
R6  34.34,66.12 90 top
R7  40.89,72.8 180 top
R8  39.73,24.71 90 top
R9  6.91,61.29 270 top
R10  3.86,61.29 270 top
R11  33.12,62.1 90 top
R13  30.25,16.89 0 top
R14  8.99,14.76 0 top
R15  40.67,59.89 90 top
R16  43.41,39.85 0 top
R17  45.06,37.03 270 top
R18  48.77,41.12 90 top
R19  52.48,40.54 270 top
R20  48.79,45.39 90 top
R21  52.63,44.83 270 top
R22  46.99,46.28 180 top
R23  46.41,50.37 180 top
R24  -23.34,29.87 180 top  (outside the outline)
R25  30.18,14.71 0 top
R26  20.62,63.46 90 top
R29  41.58,44.45 270 top
R30  18.21,63.48 90 top
U1  45.11,43.21 90 top
U2  35.79,69.57 90 top
U3  21.73,42.73 180 top
U5  22.86,24.69 180 top
U7  22.42,58.44 180 top
U$1  11.91,70.38 0 top
U$2  51.31,59.92 180 top
U$3  4.62,70.36 0 top
U$4  47.6,58.39 180 top
U$5  40.89,56.9 90 top
U$6  40.84,68.22 180 top
U$7  31.29,58.65 270 top
U$8  50.29,68.07 0 top
U$9  -13,24.23 180 top  (outside the outline)

### Tracks (layer width: path | path; a pad name or v marks a point on that pad's centre or on a via)
1.8V  (via drill 0.51)  (6 unrouted)
  Top 0.254: U1.13 46.11,45.9 R22.2 | U1.8 47.23,42.6 47.37,42.47 47.37,40.12 C9.1
  Top 0.762: R20.2 Q7.1 | R22.2 46.49,47.57 Q8.1 | R18.2 49.98,41.62 Q2.1 | R16.2 Q5.1 | Q6.1 R4.2 | R29.2 41.55,43.92 Q10.1
  Top 1.016: C11.1 53.96,59.92 U$2.2
  Bottom 1.016: R4.2 41.53,39.9 41.58,39.85 v43.97,39.85 47.03,39.85 C9.1 48.73,39.81 49.05,40.13 v49.05,41.69 49.05,45.9 v49.1,45.95 | 43.26,39.8 43.28,39.83 43.26,39.83 | v49.1,45.95 46.81,45.95 v46.27,46.5 44.97,46.5 44.83,46.63 44.9,46.7 C20.1 44.04,46.7 43.7,47.03 42.21,47.03 41.55,46.38 41.55,44.02 41.42,43.89 v41.38,43.89 | v49.1,45.95 49.1,50.16 54.28,55.35 54.28,59.88 C11.1
  other vias: 41.53,41.51 47.07,39.81 44.93,46.7 54.18,59.98
3.3V  (via drill 0.51)  (10 unrouted)
  Top 1.016: C1.1 35.9,53.87 C5.1 41.86,53.95 41.96,54.05 | U$5.VOUT 41.99,54.08 41.96,54.05 | v45.47,54.05 41.96,54.05 | U5.VDD3V3 v25.66,19.07 | v25.66,19.07 U5.VDDAON | U5.VDD3V3.2 v25.66,19.07 | v44.3,27 44.98,27.69 v44.98,31.88 | C7.1 29.24,55.64 U7.16
  Bottom 0.508: R2.2 39.83,45.93 39.83,41.12 40.26,40.69 40.26,39.24 v40.24,39.22
  Bottom 1.016: 45.59,54.18 v45.47,54.05 45.91,53.61 R23.2 44.04,50.37 43.05,49.38 40.21,49.38 40.2,49.37 R2.2 | v40.24,39.22 41.6,37.85 41.6,36.6 41.68,36.52 45.19,36.52 45.13,36.47 v45.06,36.47 | v45.06,36.47 48.97,36.47 v52.48,39.98 52.48,44.12 v52.62,44.26 | v25.66,19.07 33.53,26.95 44.3,26.95 v44.3,27 | v44.98,31.88 44.98,36.4 v45.06,36.47 | C5.1 35.98,55.28 35.6,55.66 C7.1
  other vias: 40.2,46.3 45.91,50.37 35.98,53.95 29.26,55.66
+3V3  (2 unrouted)
  Top 0.349: U3.2 15.3,32.99 17,31.29 C6.1
CHG_LED
  Top 0.349: U$6.1 42.72,68.22 43.1,68.61 43.1,72.54 42.85,72.8 R7.1
D_N  (via drill 0.51)
  Top 0.254: J1.B7 22.87,67.81 22.87,67.23 22.64,67 22.28,67 | 22.28,67 22.07,67 21.85,67.21 J1.A7 | 22.28,67 22.35,66.92 v22.35,66.29 | 20.65,61.11 U7.6 | U7.6 | v20.65,59.72 20.55,59.72 20.52,59.74 U7.6
  Top 0.349: IC1.6 25.11,63.33 v25.11,63.6
  Bottom 0.254: v22.35,66.29 22.35,66.24 21.79,65.68 21.79,65.56 21.79,59.72 v20.65,59.72
  Bottom 0.349: 24.99,63.6 v25.11,63.6 23.75,63.6 21.79,65.56
D_P  (via drill 0.51)
  Top 0.254: J1.A6 22.35,68.44 22.14,68.66 21.82,68.66 | J1.B6 21.35,68.44 21.57,68.66 21.82,68.66 | 21.82,68.66 21.87,68.71 v21.87,69.72 | v20.68,66.32 21.79,65.21 21.79,64.49 21.79,64.03 U7.5
  Top 0.349: IC1.3 22.08,64.92 21.79,65.21
  Bottom 0.254: v21.87,69.72 21.87,67.51 v20.68,66.32
DTR  (1 unrouted)
  Top 0.349: U7.13 23.06,56.49 22.1,57.45 16.36,57.45 15.46,58.35 Q1.2
FSYNC/IO36
  Top 0.254: R20.1 48.75,44.85 48.4,44.85 47.36,43.8 U1.11
  Top 0.349: R20.1 Q7.2
GND  (via drill 0.51)  (41 unrouted)
  Top 0.254: U1.20 43.04,43.8 42.9,43.94 42.9,45.41 | 42.9,45.41 44.12,45.41 44.11,45.41 U1.18 | 42.9,45.41 v43.12,45.64
  Top 0.349: IC1.2 24.21,64.99 24.21,65.6 24.44,65.82 24.72,65.82 25.5,66.6 | R30.1 18.04,62.81 v17.6,62.81 | R26.1 v20.62,62.89 | U2.2 v36.09,69.57 | U$5.GND 43.57,56.9 C19.2 44.96,57.29 45.81,58.15 46.25,58.15 U$4.2 | U5.VSS.2 7.93,12.09 7.62,12.39 7.62,12.65 | 7.62,12.65 7.62,12.93 7.92,13.23 | 12.17,13.36 12.04,13.23 7.92,13.23 | 7.62,12.65 6.86,12.65 v6.81,12.7 | U3.1 14.03,32.72 15.3,31.45 C6.2 15.24,31.19 v15.16,31.11 | 7.92,13.23 7.92,16.36 v7.8,16.48
  Top 1.016: C16.2 v34.29,54 | v34.29,54 34.29,51.8 C1.2 | C5.2 34.28,53.99 v34.29,54
  Bottom 0.349: v7.8,16.48 12.86,16.48 U5.VSS.4
  other vias: 26.87,61.24 41.64,70.31 34.34,65.27 37.85,74.43 49.29,65.72 43.97,57.29 54.18,61.68 17.78,68.4 26.42,68.4 26.42,72.58 17.78,72.58 44.93,48.4 47.07,38.11 50.58,43.31 13.06,16.29 25.66,21.89 14.46,24.69 32.03,37.02 14.03,51.73
  pour Route2: 0,76.2 55.88,76.2 55.88,0 0,0
  pour Route15: 0,76.2 55.88,76.2 55.88,0 -0.64,0 0,0.64
GPIO12
  Top 0.349: R19.1 51.23,41.02 Q2.3 51.16,33.68 30.6,33.68 U3.14
GPIO12/SDO
  Top 0.254: U1.9 47.7,43.01 48,42.7 48,42.67 48.03,42.64 48.03,40.82 48.23,40.62 R18.1
  Top 0.349: R18.1 49.98,40.62 Q2.2
GPIO13  (1 unrouted)
  Top 0.254: R17.1 Q5.3
  Top 0.349: 43.28,37.39 Q5.3 42.62,38.3 32.59,38.3
GPIO13/SDI
  Top 0.254: U1.24 43.09,42.2 42.91,42.02 R16.1
  Top 0.349: R16.1 Q5.2
GPIO14  (via drill 0.51)
  Top 0.349: Q6.3 39.12,41.96 R5.1 39.15,39.78 v34.7,39.78
  Bottom 0.349: v34.7,39.78 34.7,31.73 29.34,31.73 29.27,31.79 U3.13
  other vias: 29.27,33.73
GPIO14/SCLK
  Top 0.254: U1.23 41.62,42.6 R4.1
  Top 0.349: R4.1 Q6.2
GPIO15
  Top 0.254: Q10.3 39.07,46.17 R2.1
  Top 0.349: 38.98,44.51 Q10.3 36.6,46.89 32.33,46.89 U3.23
GPIO15/CS
  Top 0.254: U1.22 42.92,43.01 42.39,43.54 42.39,44.93 42.38,44.95 R29.1
  Top 0.349: R29.1 40.24,44.95 Q10.2
GPIO35
  Top 0.349: U5.GPIO7 26.68,16.29 28.17,17.78 28.17,26.21 26.8,27.58 21.65,27.58 U3.7
INT/IO39
  Top 0.254: U1.12 47.11,44.65 47.17,44.65 47.17,45.96 R22.1
  Top 0.349: R22.1 47.49,47.54 Q8.2
IO0  (via drill 0.51)  (3 unrouted)
  Top 0.349: Q1.3 11.81,55.37 11.91,55.27 15.37,55.27 15.42,55.22 v15.42,54.38 | v14.2,49.07 14.2,45.92 16.61,43.51 17.45,43.51 17.83,43.89 17.83,46.69 18.39,47.24 30.48,47.24 30.54,47.31 U3.25
  Bottom 0.349: v15.42,54.38 15.42,50.29 v14.2,49.07
IO5  (via drill 0.51)  (1 unrouted)
  Top 0.349: U5.SPICSN 13.06,26.04 14.38,27.36 v18.26,27.36
  Bottom 0.349: v18.26,27.36 23.27,32.36 23.27,37.11 24.54,38.38 25.6,38.38 25.6,50.68 v25.52,50.76
IO18  (via drill 0.51)
  Top 0.349: U5.SPICLK 12.16,17.69 v12.07,17.6
  Bottom 0.349: v12.07,17.6 8.74,17.6 7.19,19.15 7.19,22.68 14.1,29.59 14.1,46.74 17.2,49.84 24.16,49.84 24.19,49.87 U3.30
  other vias: 24.19,51.73
IO19  (via drill 0.51)
  Top 0.349: v22.86,48.67 22.92,48.73 U3.31
  Bottom 0.349: U5.SPIMISO 9.08,19.09 8.41,19.76 8.41,22.17 16.82,30.58 16.82,31.9 15.09,33.63 15.09,46.43 17.39,48.73 22.8,48.73 v22.86,48.67
  other vias: 13.06,19.09
IO23  (via drill 0.51)
  Top 0.349: U5.SPIMOSI 9.64,20.49 9.45,20.68 9.45,26.72 11.38,28.65 16.79,28.65 v16.84,28.6 | v16.54,45.9 15.3,47.13 U3.37
  Bottom 0.349: v16.84,28.6 21.95,33.71 21.95,37.72 20.62,39.04 16.89,39.04 16.05,39.88 16.05,45.41 v16.54,45.9
IO27
  Top 0.349: R13.2 33.17,16.89 33.93,17.65 34.01,17.65 34.01,31.34 28.4,31.34 28,31.74 U3.12
IO32  (via drill 0.51)
  Top 0.349: R25.2 33.86,14.71 v34.04,14.88 | v32.36,19.48 30.1,21.74 30.1,26.87 27.91,29.06 25.02,29.06 22.92,31.15 U3.8
  Bottom 0.349: v34.04,14.88 32.77,16.15 32.77,19.48 v32.36,19.48
IO33  (via drill 0.51)
  Top 0.349: U3.9 24.16,33.7 24.16,31.73 25.5,30.38 32.18,30.38 32.18,22.3 v32.21,22.28 | R1.2 34.92,12.55 37.21,14.83 v37.21,19.66
  Bottom 0.349: v37.21,19.66 34.67,22.2 32.21,22.2 v32.21,22.28
IO34  (3 unrouted)
  Top 0.254: 47.05,49.94 46.96,50.13
  Top 0.349: 47.09,48.67 47.04,48.72 | U5.IRQ/GPIO8 12.9,14.73 | U3.6 20.47,33.65 20.47,31.17 19.02,29.72 8.53,29.72 7.49,28.68 7.49,19.6 9.77,17.32 9.96,17.32 9.96,14.87 R14.2 12.93,14.76 U5.IRQ/GPIO8 | U5.IRQ/GPIO8 12.72,15.22
IO36  (via drill 0.51)
  Top 0.349: R21.1 51.39,45.33 Q7.3 | R21.1 53.15,45.33 | R21.1 53.65,45.33 54.43,44.55 54.43,36.04 v53.67,35.28 | v47.83,34.74 32.21,34.74 31.57,35.38 v20.8,35.38
  Bottom 0.349: v53.67,35.28 53.13,34.74 v47.83,34.74 | v20.8,35.38 19.15,33.73 U3.4
  other vias: 17.84,33.73
IO39  (via drill 0.51)
  Top 0.349: Q8.3 47.02,50.26 R23.1 46.91,51.21 46.08,52.05 41.73,52.05 38.61,48.92 v37.06,48.92 | v29.46,44.73 29.16,44.42 29.16,39.42 28.68,38.94 20.12,38.94 19.15,37.97 19.15,33.77 U3.5
  Bottom 0.349: v37.06,48.92 37.06,45.8 35.99,44.73 v29.46,44.73
N$1  (1 unrouted)
N$2  (via drill 0.51)  (1 unrouted)
  Top 0.349: Q1.1 14.13,56.45 v14.25,56.33
  Bottom 0.349: v14.25,56.33 14.25,55.45 13.89,55.09 10.59,55.09 9.42,56.26 9.42,56.92
N$3
  Top 0.349: U2.5 34.49,67.11 R6.2
N$4  (1 unrouted)
N$5
  Top 0.349: 20.35,67.5 J1.B5 20.35,67.29 19.56,66.5 19.56,65.02 R26.2
N$6  (via drill 0.51)  (1 unrouted)
  Top 0.349: J1.A5 23.35,71.42 v23.34,71.42
  Bottom 0.349: v23.34,71.42 22.7,70.79 21.43,70.79 20.81,70.16 20.81,67.95 18.65,65.8 18.65,65.33 18.21,64.9 v18.21,64.05
N$7
  Top 0.349: U2.1 39.7,68.62 U$6.2
N$8
  Top 1.016: U$4.4 U$4.5 49.88,59.34 U$2.1
N$9  (via drill 0.51)  (1 unrouted)
  Top 0.349: R15.2 41.05,60.78 v42.04,60.78
  Bottom 0.349: v42.04,60.78 42.04,58.03 v41.99,57.98
N$10
  Top 0.349: U5.EXTON 26.12,12.55 R1.1
N$11
  Top 0.349: U5.WAKEUP 27.89,13.49 29.11,14.71 R25.1
N$12
  Top 0.349: U5.RST 27.4,14.89 R13.1
N$13
  Top 0.254: U1.10 48.78,43.41 C8.1
N$14
  Top 0.349: U$5.C- 39.37,57.85 39.25,57.96 37.55,57.96 C12.1
N$15
  Top 0.349: U$5.C+ 39.37,55.95 39.25,55.83 37.65,55.83 C12.2
RESET  (via drill 0.51)  (5 unrouted)
  Top 0.349: Q4.3 11.81,61.7 11.81,64.14 15.82,64.14 16.04,63.92 v16.04,63.55 | v26.52,37.13 26.39,37.01 v20.88,37.01
  Bottom 0.349: v16.04,63.55 16.04,56.51 16.69,55.85 16.69,52.66 18.67,50.67 21.63,50.67 23.75,52.8 24.99,52.8 26.59,51.2 26.59,50.32 26.52,50.25 v26.52,37.13 | v20.88,37.01 20.35,36.47 16.76,36.47 16.55,36.26 v16.55,34.73
RTS  (1 unrouted)
  Top 0.349: U7.14 24.33,56.8 22.53,58.6 17.78,58.6 17.7,58.52 17.5,58.52 15.88,60.15 15.88,62.2 15.48,62.6 Q4.2
RX-TX_N  (via drill 0.51)
  Top 0.349: U7.2 25.6,57.7 v25.55,57.66 | v20.42,54.18 20.24,54 18.26,54 17.84,53.58 U3.35
  Bottom 0.349: v25.55,57.66 25.04,57.15 21.31,57.15 20.47,56.31 20.47,54.18 v20.42,54.18
RX-TX_P  (via drill 0.51)
  Top 0.349: U7.3 24.33,59.38 24.26,59.31 v24.23,59.33
  Bottom 0.349: v24.23,59.33 22.94,58.04 19.91,58.04 19.15,58.8 18.59,58.8 18.59,57.47 19.11,57.47 U3.34
  other vias: 19.11,51.73
V_BATT  (via drill 0.51)
  Top 0.762: 37.51,70.94 U2.3
  Top 1.016: U$8.4 51.29,63.31 51.28,63.3 38.56,63.3 | 38.56,63.3 37.17,61.91 Q3.3 | 38.56,63.3 38.51,63.35 v38.51,64.85 | C17.1 39.31,70.94 v38.51,70.94 37.51,70.94
  Bottom 1.016: v38.51,64.85 v38.51,70.94
V_IN  (via drill 0.51)  (3 unrouted)
  Top 0.349: U$4.3 46.75,57.69 47.19,57.69 47.65,58.16 47.65,58.93 47.23,59.34 U$4.1
  Top 1.016: Q3.2 34.29,59.99 | C16.1 34.29,59.99 | 34.29,59.99 39.41,59.99 40.02,59.38 43.58,59.38 43.61,59.34 | 43.61,59.34 C19.1 | U$4.1 43.61,59.34
  Bottom 1.016: C16.1 35.93,57.75 36.78,56.9 v38.81,56.9
  other vias: 34.29,57.75
V_USB  (via drill 0.51)  (4 unrouted)
  Top 0.762: J1.VBUS1 24.55,67.22 v23.9,66.57 | v26.24,64.92 24.93,64.92
  Top 1.016: v26.24,64.92 28.88,64.92 | Q3.1 35,62.74 31.06,62.74 | 28.88,64.92 31.06,62.74 | 28.88,64.92 30.63,66.67 30.63,70.51 30.64,70.52 U2.4 34.21,70.8 34.21,72.8 R7.2 | U$7.1 31.29,62.51 31.06,62.74
  Bottom 0.762: v23.9,66.57 25.55,64.92 v26.24,64.92
(copper drawn outside any net)
  shapes: Route15 area x2, Route2 area x1